# Altium schematic sheet Pulse_Generator.SchDoc
size A
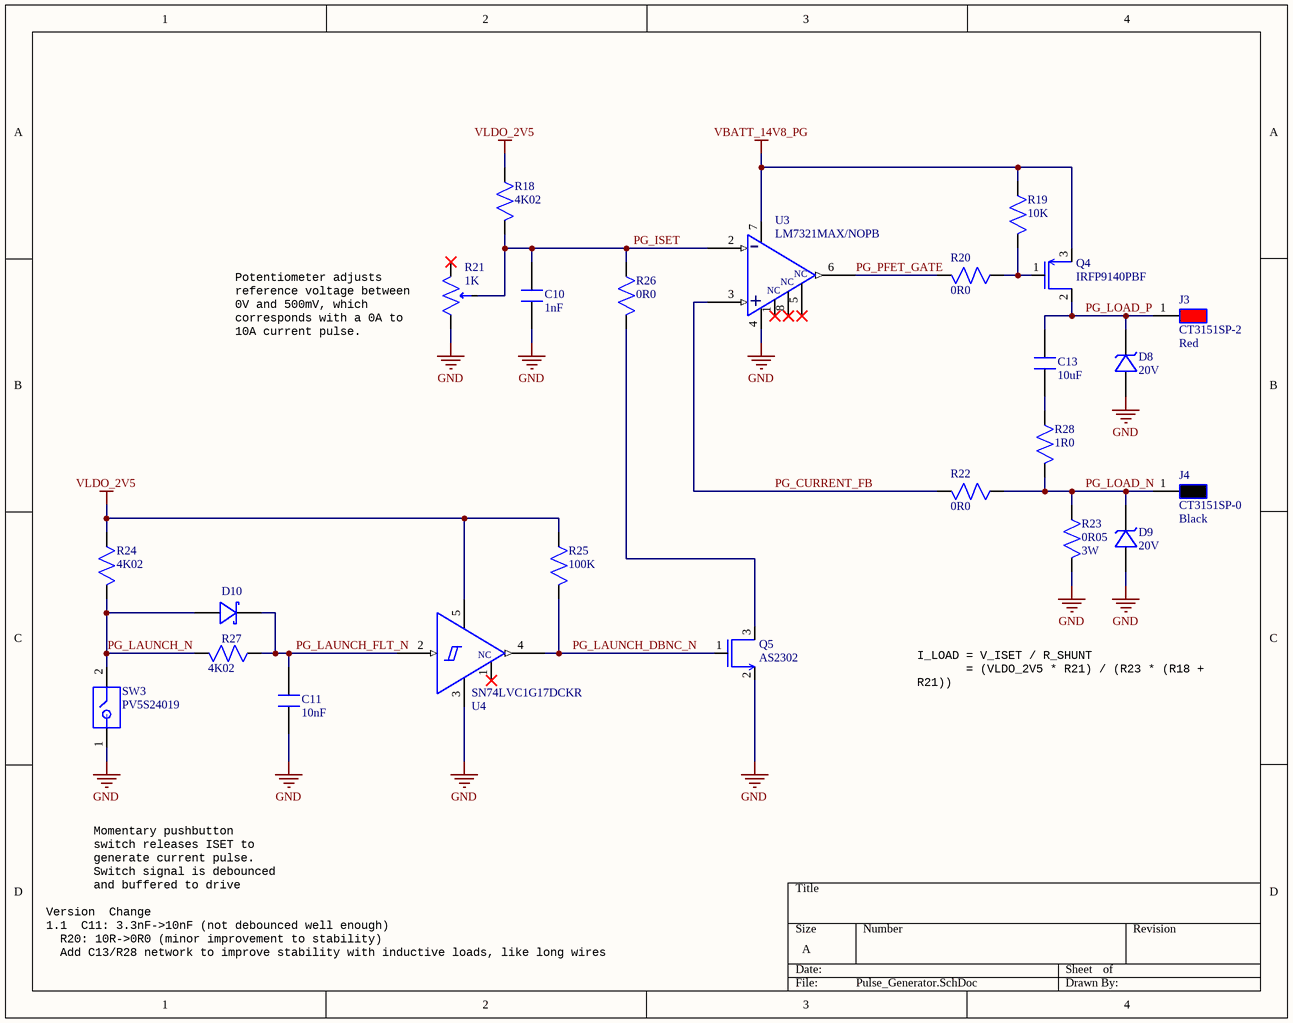
[diagram p0: Pulse_Generator.SchDoc]

## Parts
C10  Capacitance: 1nF  [0603_CAP]
C11  Capacitance: 10nF  [0603_CAP]  (hidden comment: CAP_0603_10nF)
C13  Capacitance: 10uF  [0805_CAP]  (hidden comment: CAP_0805_10uF)
D8  Reverse Standoff Voltage: 20V  [DO-214AC_SMA]  (hidden comment: *)
D9  Reverse Standoff Voltage: 20V  [DO-214AC_SMA]  (hidden comment: *)
D10  *  [SOD-523]  (value not drawn)
J3  Part Number: CT3151SP-2  Colour: Red  [CONN_BANANA_RED_CT3151SP-2]  (hidden comment: *)
J4  Part Number: CT3151SP-0  Colour: Black  [CONN_BANANA_BLK_CT3151SP-0]  (hidden comment: *)
Q4  Part Number: IRFP9140PBF  [TO-247AC_NOHOLE]  (hidden comment: *)
Q5  Part Number: AS2302  [SOT-23-3]  (hidden comment: *)
R18  Resistance: 4K02  [0603_RES]
R19  Resistance: 10K  [0603_RES]
R20  Resistance: 0R0  [0603_RES]
R21  Resistance: 1K  [POT_PTV09A-4x15F-xxxx]
R22  Resistance: 0R0  [0603_RES]
R23  Resistance: 0R05  Power Rating: 3W  [RES_BR3FB50L0_0R05_1%]
R24  Resistance: 4K02  [0603_RES]
R25  Resistance: 100K  [0603_RES]
R26  Resistance: 0R0  [0603_RES]
R27  Resistance: 4K02  [0603_RES]
R28  Resistance: 1R0  [0805_RES]  (hidden comment: RES_0805_1R0)
SW3  Part Number: PV5S24019  [SW_PUSHBUTTON_PV5S24019]  (hidden comment: *)
U3  Part Number: LM7321MAX/NOPB  [SOIC-8_TI_PACKAGE_D]  (hidden comment: *)
U4  Part Number: SN74LVC1G17DCKR  [SOT-353]  (hidden comment: *)

## Nets
GND: C10.1 C11.1 D8.2 D9.2 Q5.2(S) R21.1 R23.1 SW3.1 U3.4(V-) U4.3(GND)
VBATT_14V8_PG: Q4.3(S) R19.2 U3.7(V+)
VLDO_2V5: R18.2 R24.2 R25.2 U4.5(VCC)
PG_CURRENT_FB: R22.1 U3.3(IN+)
PG_ISET: C10.2 R18.1 R21.2 R26.2 U3.2(IN-)
PG_LAUNCH_DBNC_N: Q5.1(G) R25.1 U4.4(Y)
PG_LAUNCH_FLT_N: C11.2 D10.1 R27.2 U4.2(A)
PG_LAUNCH_N: D10.2 R24.1 R27.1 SW3.2
PG_LOAD_N: D9.1 J4.1 R22.2 R23.2 R28.1
PG_LOAD_P: C13.2 D8.1 J3.1 Q4.2(D)
PG_PFET_GATE: R20.1 U3.6(OUT)
NetC13_1: C13.1 R28.2
NetQ4_1: Q4.1(G) R19.1 R20.2
NetQ5_3: Q5.3(D) R26.1

Not connected (* = marked no-connect by the designer): R21 3*; U3 1(NC)* 5(NC)* 8(NC)*; U4 1(NC)*

## Notes on the sheet
- (near R21) Potentiometer adjusts reference voltage between 0V and 500mV, which corresponds with a 0A to 10A current pulse.
- I_LOAD = V_ISET / R_SHUNT
  = (VLDO_2V5 * R21) / (R23 * (R18 + R21))
  = (2.5 * R21) / (0.05 * (4020 + R21))
- Momentary pushbutton switch releases ISET to generate current pulse. Switch signal is debounced and buffered to drive NFET.
- Version		Change
  1.1		C11: 3.3nF->10nF (not debounced well enough)
  R20: 10R->0R0 (minor improvement to stability)
  Add C13/R28 network to improve stability with inductive loads, like long wires
- (in symbol LM7321) -; +

## Library data of the parts
C10 = CAP_0603_1nF: Manufacturer: KYOCERA AVX; Part Number: KGM15AR71H102KT; Tolerance: 10%; Voltage: 50V; Dielectric: X7R
C11 = CAP_0603_10nF: Manufacturer: Samsung Electro-Mechanics; Part Number: CL10B103KB8NNNC; Tolerance: 10%; Voltage: 50V; Dielectric: X7R
C13 = CAP_0805_10uF: Manufacturer: Yageo; Part Number: CC0805KKX5R5BB106; Tolerance: 10%; Voltage: 6.3V
D8 D9 = DIODE_TVS_20V_UNIDIR: Manufacturer: Diodes Incorporated; Part Number: SMAJ20AQ-13-F; Package: DO-214AC_SMA
D10 = DIODE_RB520S30T5G: Manufacturer: ON Semiconductor; Max Reverse Voltage: 30V; Part Number: RB520S30T5G; Package: SOD-523
J3 = CONN_BANANA_RED_CT3151SP-2: Manufacturer: Cal Test Electronics
J4 = CONN_BANANA_BLK_CT3151SP-2_1: Manufacturer: Cal Test Electronics
Q4 = PFET_IRFP9140: Manufacturer: Vishay; Package: TO-247-3
Q5 = NFET_AS2302: Manufacturer: ANBON SEMICONDUCTOR (INT'L) LIMITED; Package: SOT-23-3
R18 R24 R27 = RES_0603_4K02: Manufacturer: Stackpole Electronics Inc; Part Number: RMCF0603FT4K02; Tolerance: 1%; Temperature Coefficient: 100ppm; Power Rating: 0.1W
R19 = RES_0603_10K: Manufacturer: Stackpole Electronics Inc; Part Number: RMCF0603FT10K0; Tolerance: 1%; Temperature Coefficient: 100ppm; Power Rating: 0.1W
R20 R22 R26 = RES_0603_0R0
R21 = POT_1K_PTV09A-4015F-B102: Manufacturer: Bourns Inc.; Tolerance: 20%; Power Rating: 0.05W; Part Number: PTV09A-4015F-B102
R23 = RES_BR3FB50L0_0R05_1%: Manufacturer: Stackpole Electronics; Tolerance: 1%; Part Number: BR3FB50L0
R25 = RES_0603_100K: Manufacturer: Stackpole; Part Number: RMCF0603FT100K; Tolerance: 1%; Temperature Coefficient: 100ppm; Power Rating: 0.1W
R28 = RES_0805_1R0: Manufacturer: Stackpole Electronics Inc; Part Number: RMCF0805FT1R00; Tolerance: 1%; Temperature Coefficient: 200ppm; Power Rating: 0.125W
SW3 = SW_PUSHBUTTON_PV5S24019: Manufacturer: E-Switch
U3 = LM7321: Manufacturer: Texas Instruments; Package: SOIC-8
U4 = SN74LVC1G17: Manufacturer: Texas Instruments; Package: SOT-353